# Altium schematic sheet Main.SchDoc
size A4; CompanyName: Motonaut Electronics; DrawnBy: Simon; SheetNumber: 1; SheetTotal: 6
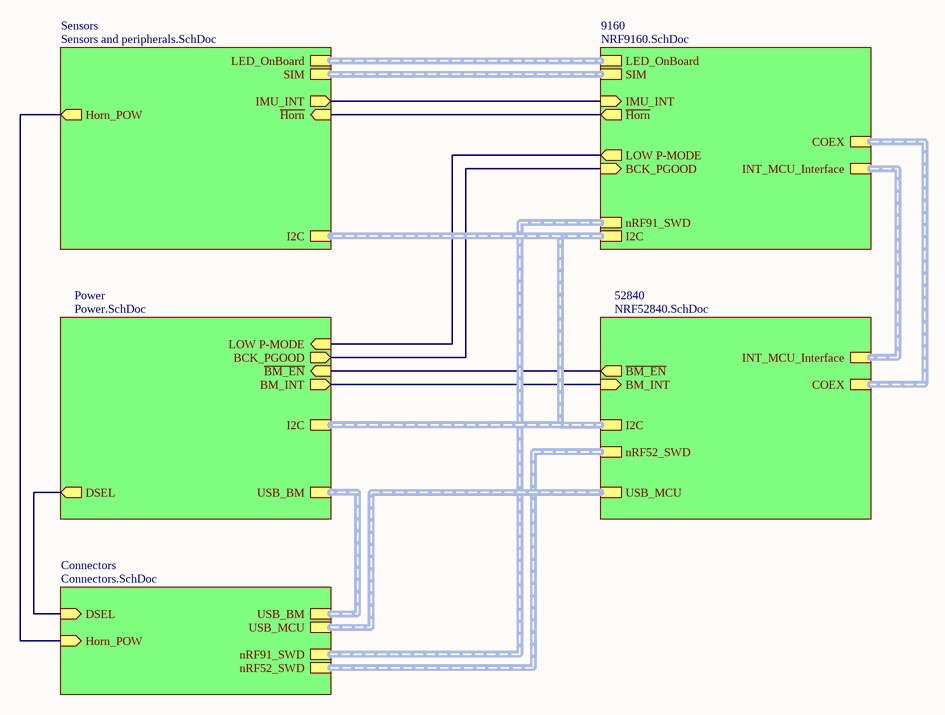
[diagram p0: Main.SchDoc]

## Sub-sheets
9160 = NRF9160.SchDoc: I2C (harness I2C), nRF91_SWD (harness SWD), LED_OnBoard (harness LED_CTRL), ~{Horn} (out), COEX (harness COEX), IMU_INT (in), SIM (harness SIM), LOW P-MODE (out), BCK_PGOOD (in), INT_MCU_Interface (harness USB)
52840 = NRF52840.SchDoc: I2C (harness I2C), USB_MCU (harness USB), nRF52_SWD (harness SWD), COEX (harness COEX), INT_MCU_Interface (harness USB), BM_INT (in), ~{BM_EN} (out)
Connectors = Connectors.SchDoc: nRF52_SWD (harness SWD), nRF91_SWD (harness SWD), Horn_POW (in), USB_BM (harness USB), USB_MCU (harness USB), DSEL (in)
Power = Power.SchDoc: I2C (harness I2C), LOW P-MODE (in), BCK_PGOOD (out), ~{BM_EN} (in), BM_INT (out), USB_BM (harness USB), DSEL (out)
Sensors = Sensors and peripherals.SchDoc: LED_OnBoard (harness LED_CTRL), ~{Horn} (in), IMU_INT (out), SIM (harness SIM), I2C (harness I2C), Horn_POW (out)

## Nets
(unnamed): sheet Power/LOW P-MODE, sheet 9160/LOW P-MODE
(unnamed): sheet Power/BCK_PGOOD, sheet 9160/BCK_PGOOD
(unnamed): sheet Power/~{BM_EN}, sheet 52840/~{BM_EN}
(unnamed): sheet Power/BM_INT, sheet 52840/BM_INT
(unnamed): sheet Power/DSEL, sheet Connectors/DSEL
(unnamed): sheet 9160/~{Horn}, sheet Sensors/~{Horn}
(unnamed): sheet 9160/IMU_INT, sheet Sensors/IMU_INT
(unnamed): sheet Sensors/Horn_POW, sheet Connectors/Horn_POW

## Buses and harness runs
harness sheet 9160/COEX = sheet 52840/COEX
harness sheet 9160/I2C = sheet 52840/I2C = sheet Power/I2C = sheet Sensors/I2C
harness sheet 9160/INT_MCU_Interface = sheet 52840/INT_MCU_Interface
harness sheet 9160/LED_OnBoard = sheet Sensors/LED_OnBoard
harness sheet 9160/nRF91_SWD = sheet Connectors/nRF91_SWD
harness sheet 9160/SIM = sheet Sensors/SIM
harness sheet 52840/nRF52_SWD = sheet Connectors/nRF52_SWD
harness sheet 52840/USB_MCU = sheet Connectors/USB_MCU
harness sheet Connectors/USB_BM = sheet Power/USB_BM